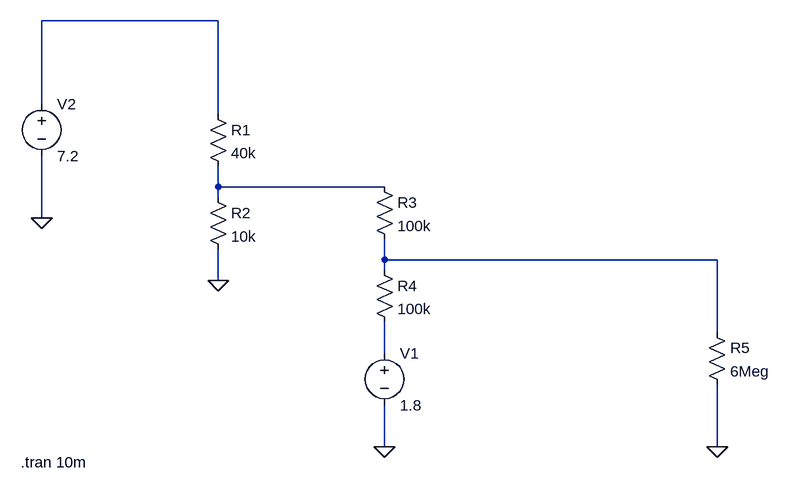
[diagram p0: schematic Draft1.asc]
Draft1.asc, the LTspice schematic file:
Version 4.1
SHEET 1 888 680
WIRE 32 -64 -240 -64
WIRE -240 64 -240 -64
WIRE 32 80 32 -64
WIRE 32 192 32 160
WIRE 288 192 32 192
WIRE 32 208 32 192
WIRE -240 240 -240 144
WIRE 288 304 288 272
WIRE 800 304 288 304
WIRE 288 320 288 304
WIRE 32 336 32 288
WIRE 800 416 800 304
WIRE 288 448 288 400
WIRE 288 592 288 528
WIRE 800 592 800 496
FLAG 32 336 0
FLAG -240 240 0
FLAG 288 592 0
FLAG 800 592 0
SYMBOL res 16 64 R0
SYMATTR InstName R1
SYMATTR Value 40k
SYMBOL res 16 192 R0
SYMATTR InstName R2
SYMATTR Value 10k
SYMBOL res 272 176 R0
SYMATTR InstName R3
SYMATTR Value 100k
SYMBOL res 272 304 R0
SYMATTR InstName R4
SYMATTR Value 100k
SYMBOL voltage 288 432 R0
WINDOW 123 0 0 Left 0
WINDOW 39 0 0 Left 0
SYMATTR InstName V1
SYMATTR Value 1.8
SYMBOL voltage -240 48 R0
WINDOW 123 0 0 Left 0
WINDOW 39 0 0 Left 0
SYMATTR InstName V2
SYMATTR Value 7.2
SYMBOL res 784 400 R0
SYMATTR InstName R5
SYMATTR Value 6Meg
TEXT -272 616 Left 2 !.tran 10m

The netlist it stands for:
* Draft1.asc
R1 N001 N002 40k
R2 N002 0 10k
R3 N002 N003 100k
R4 N003 N004 100k
V1 N004 0 1.8
V2 N001 0 7.2
R5 N003 0 6Meg
.tran 10m
.backanno
.end